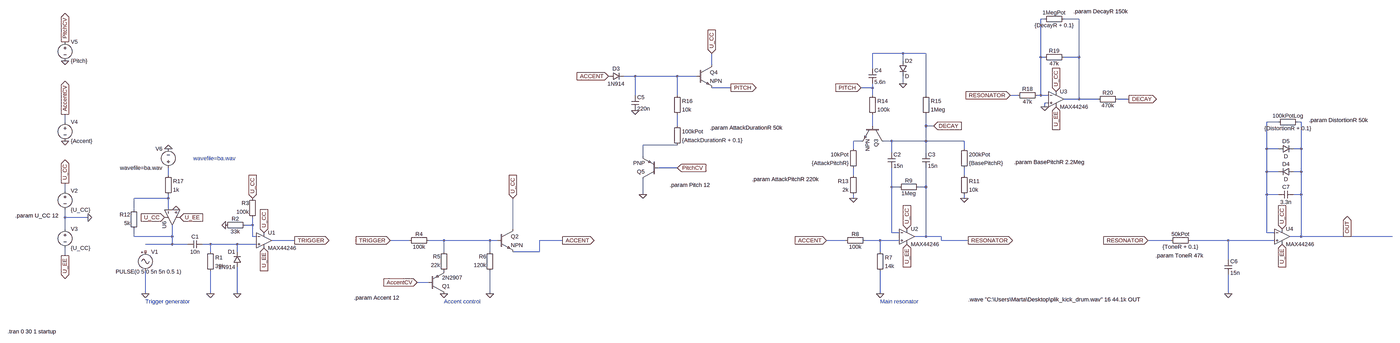
[diagram p0: schematic OPENLAB-KickDrum.asc, whole sheet]
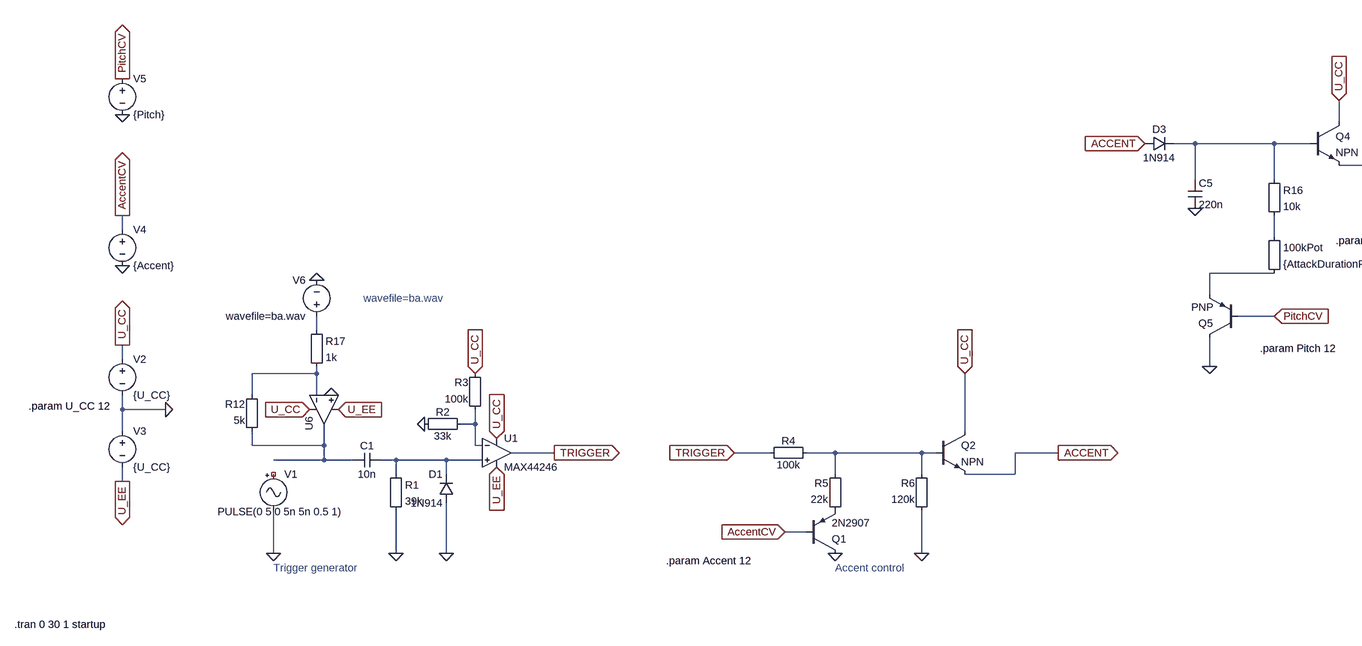
[diagram p1: schematic OPENLAB-KickDrum.asc, part, row 1 of 1, column 1 of 2]
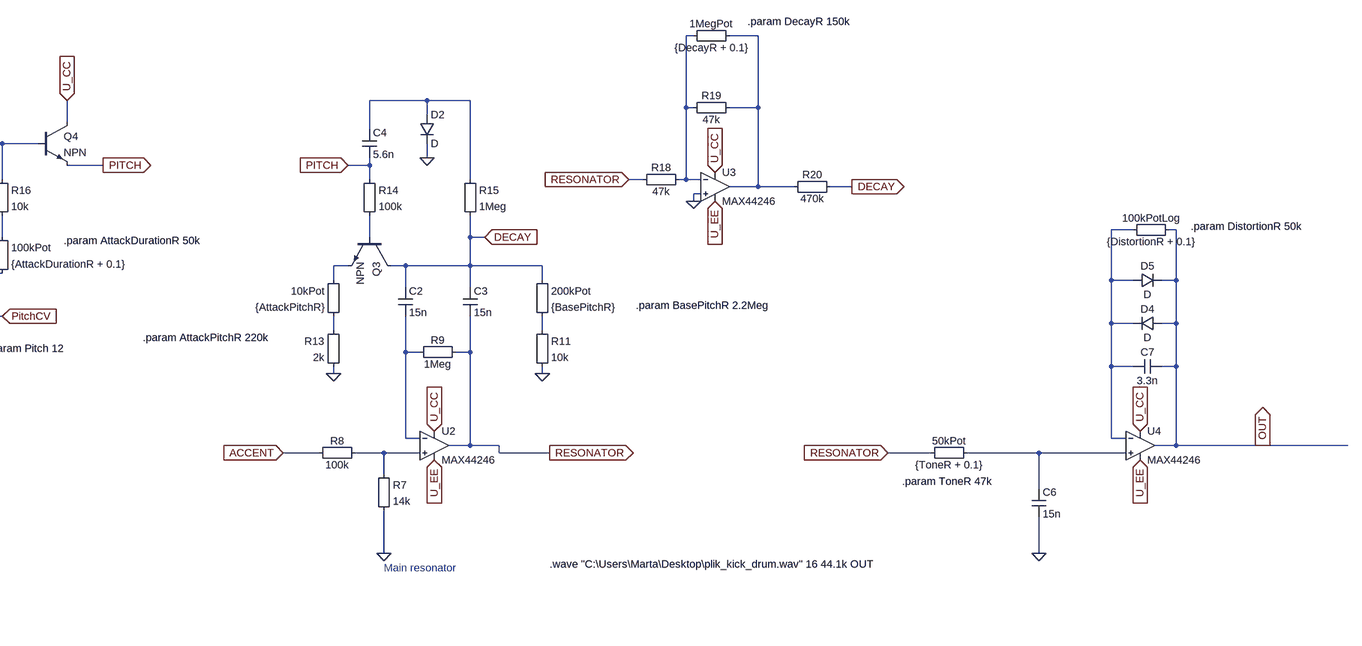
[diagram p2: schematic OPENLAB-KickDrum.asc, part, row 1 of 1, column 2 of 2]
OPENLAB-KickDrum.asc, the LTspice schematic file:
Version 4
SHEET 1 6012 708
WIRE 3888 -848 3872 -848
WIRE 4032 -848 3968 -848
WIRE 3296 -704 3168 -704
WIRE 3392 -704 3296 -704
WIRE 3872 -688 3872 -848
WIRE 3888 -688 3872 -688
WIRE 4032 -688 4032 -848
WIRE 4032 -688 3968 -688
WIRE 3296 -672 3296 -704
WIRE 2496 -656 2496 -704
WIRE 3168 -640 3168 -704
WIRE 2176 -608 2128 -608
WIRE 2352 -608 2176 -608
WIRE 2432 -608 2352 -608
WIRE 3296 -576 3296 -608
WIRE 2576 -560 2496 -560
WIRE 3168 -560 3168 -576
WIRE 3168 -560 3120 -560
WIRE 2176 -528 2176 -608
WIRE 2352 -528 2352 -608
WIRE 3168 -528 3168 -560
WIRE 3392 -528 3392 -704
WIRE 3776 -528 3744 -528
WIRE 3872 -528 3872 -688
WIRE 3872 -528 3856 -528
WIRE 3904 -528 3872 -528
WIRE 4032 -512 4032 -688
WIRE 4032 -512 3968 -512
WIRE 4112 -512 4032 -512
WIRE 4240 -512 4192 -512
WIRE 3904 -496 3888 -496
WIRE 3888 -480 3888 -496
WIRE -320 -416 -320 -448
WIRE 4880 -416 4832 -416
WIRE 4976 -416 4960 -416
WIRE 2352 -400 2352 -448
WIRE 3168 -400 3168 -448
WIRE 3392 -400 3392 -448
WIRE 3424 -400 3392 -400
WIRE 3120 -336 3088 -336
WIRE 3248 -336 3216 -336
WIRE 3392 -336 3392 -400
WIRE 3392 -336 3248 -336
WIRE 3552 -336 3392 -336
WIRE 2352 -320 2208 -320
WIRE 3088 -304 3088 -336
WIRE 3552 -304 3552 -336
WIRE 4832 -304 4832 -416
WIRE 4880 -304 4832 -304
WIRE 4976 -304 4976 -416
WIRE 4976 -304 4944 -304
WIRE 3248 -288 3248 -336
WIRE 3392 -288 3392 -336
WIRE 2208 -272 2208 -320
WIRE 2352 -224 2272 -224
WIRE 4832 -208 4832 -304
WIRE 4880 -208 4832 -208
WIRE 4976 -208 4976 -304
WIRE 4976 -208 4944 -208
WIRE 112 -192 112 -224
WIRE 3088 -192 3088 -224
WIRE 3552 -192 3552 -224
WIRE 3248 -144 3248 -224
WIRE 3280 -144 3248 -144
WIRE 3392 -144 3392 -224
WIRE 3392 -144 3360 -144
WIRE -320 -128 -320 -160
WIRE 2208 -112 2208 -176
WIRE 4832 -112 4832 -208
WIRE 4880 -112 4832 -112
WIRE 4976 -112 4976 -208
WIRE 4976 -112 4944 -112
WIRE 112 -96 112 -112
WIRE 112 -96 -32 -96
WIRE 3088 -96 3088 -112
WIRE 3552 -96 3552 -112
WIRE -32 -48 -32 -96
WIRE 112 -48 112 -96
WIRE -320 -16 -320 -48
WIRE -224 -16 -320 -16
WIRE 464 16 464 -16
WIRE 464 16 432 16
WIRE -320 32 -320 -16
WIRE 1664 32 1664 -96
WIRE 3248 48 3248 -144
WIRE 3280 48 3248 48
WIRE 4832 48 4832 -112
WIRE 4864 48 4832 48
WIRE -32 64 -32 32
WIRE 128 64 128 16
WIRE 128 64 -32 64
WIRE 464 64 464 16
WIRE 480 64 464 64
WIRE 3392 64 3392 -144
WIRE 3392 64 3344 64
WIRE 3456 64 3392 64
WIRE 4976 64 4976 -112
WIRE 4976 64 4928 64
WIRE 5168 64 4976 64
WIRE 5584 64 5168 64
WIRE 640 80 544 80
WIRE 1232 80 1152 80
WIRE 1376 80 1312 80
WIRE 1568 80 1376 80
WIRE 1600 80 1568 80
WIRE 1872 80 1776 80
WIRE 3056 80 2976 80
WIRE 3200 80 3136 80
WIRE 3280 80 3200 80
WIRE 3456 80 3456 64
WIRE 3568 80 3456 80
WIRE 4416 80 4320 80
WIRE 4656 80 4496 80
WIRE 4864 80 4656 80
WIRE 128 96 128 64
WIRE 128 96 16 96
WIRE 192 96 128 96
WIRE 288 96 256 96
WIRE 400 96 288 96
WIRE 480 96 400 96
WIRE 288 128 288 96
WIRE 400 128 400 96
WIRE 1376 128 1376 80
WIRE 1568 128 1568 80
WIRE 1776 128 1776 80
WIRE 1776 128 1664 128
WIRE 3200 128 3200 80
WIRE -320 144 -320 112
WIRE 4656 160 4656 80
WIRE 1312 256 1264 256
WIRE 16 304 16 208
WIRE 288 304 288 208
WIRE 400 304 400 192
WIRE 1568 304 1568 208
WIRE 3200 304 3200 208
WIRE 4656 304 4656 224
FLAG 16 304 0
FLAG 400 304 0
FLAG -224 -16 0
FLAG -320 -160 U_CC
IOPIN -320 -160 Out
FLAG -320 144 U_EE
IOPIN -320 144 Out
FLAG 512 48 U_CC
IOPIN 512 48 In
FLAG 512 112 U_EE
IOPIN 512 112 In
FLAG 464 -96 U_CC
IOPIN 464 -96 In
FLAG 352 16 0
FLAG 288 304 0
FLAG 1568 304 0
FLAG 1376 304 0
FLAG 1664 -96 U_CC
IOPIN 1664 -96 In
FLAG 640 80 TRIGGER
IOPIN 640 80 Out
FLAG 1152 80 TRIGGER
IOPIN 1152 80 In
FLAG 1872 80 ACCENT
IOPIN 1872 80 Out
FLAG 1264 256 AccentCV
IOPIN 1264 256 In
FLAG -320 -336 0
FLAG -320 -448 AccentCV
IOPIN -320 -448 Out
FLAG 3312 96 U_EE
IOPIN 3312 96 In
FLAG 3312 32 U_CC
IOPIN 3312 32 In
FLAG 3200 304 0
FLAG 2976 80 ACCENT
IOPIN 2976 80 In
FLAG 3568 80 RESONATOR
IOPIN 3568 80 Out
FLAG 3552 -96 0
FLAG 3088 -96 0
FLAG 3296 -576 0
FLAG 3120 -560 PITCH
IOPIN 3120 -560 In
FLAG 2576 -560 PITCH
IOPIN 2576 -560 Out
FLAG 2496 -704 U_CC
IOPIN 2496 -704 In
FLAG 2176 -464 0
FLAG 2208 -112 0
FLAG 2064 -608 ACCENT
IOPIN 2064 -608 In
FLAG 2352 -224 PitchCV
IOPIN 2352 -224 In
FLAG 3888 -480 0
FLAG 3936 -544 U_CC
IOPIN 3936 -544 In
FLAG 3936 -480 U_EE
IOPIN 3936 -480 In
FLAG 3744 -528 RESONATOR
IOPIN 3744 -528 In
FLAG 4240 -512 DECAY
IOPIN 4240 -512 Out
FLAG 3424 -400 DECAY
IOPIN 3424 -400 In
FLAG 4320 80 RESONATOR
IOPIN 4320 80 In
FLAG 4656 304 0
FLAG 4896 96 U_EE
IOPIN 4896 96 In
FLAG 4896 32 U_CC
IOPIN 4896 32 In
FLAG 5168 64 OUT
IOPIN 5168 64 Out
FLAG -320 -672 0
FLAG -320 -752 PitchCV
IOPIN -320 -752 Out
FLAG 112 -304 0
FLAG 160 -16 U_EE
IOPIN 160 -16 In
FLAG 96 -16 U_CC
IOPIN 96 -16 In
FLAG 144 -48 0
SYMBOL Misc\\signal 16 112 R0
WINDOW 3 -124 99 Left 2
WINDOW 123 0 0 Left 0
WINDOW 39 0 0 Left 0
SYMATTR Value PULSE(0 5 0 5n 5n 0.5 1)
SYMATTR InstName V1
SYMBOL cap 256 80 R90
WINDOW 0 0 32 VBottom 2
WINDOW 3 32 32 VTop 2
SYMATTR InstName C1
SYMATTR Value 10n
SYMBOL Misc\\EuropeanResistor 272 112 R0
SYMATTR InstName R1
SYMATTR Value 39k
SYMBOL voltage -320 -144 R0
WINDOW 123 0 0 Left 0
WINDOW 39 0 0 Left 0
SYMATTR InstName V2
SYMATTR Value {U_CC}
SYMBOL voltage -320 16 R0
WINDOW 123 0 0 Left 0
WINDOW 39 0 0 Left 0
SYMATTR InstName V3
SYMATTR Value {U_CC}
SYMBOL Misc\\EuropeanResistor 448 0 R90
WINDOW 0 5 56 VBottom 2
WINDOW 3 27 56 VTop 2
SYMATTR InstName R2
SYMATTR Value 33k
SYMBOL Misc\\EuropeanResistor 480 0 R180
WINDOW 0 31 76 Left 2
WINDOW 3 31 40 Left 2
SYMATTR InstName R3
SYMATTR Value 100k
SYMBOL diode 416 192 R180
WINDOW 0 24 64 Left 2
WINDOW 3 24 0 Left 2
SYMATTR InstName D1
SYMATTR Value 1N914
SYMBOL Misc\\EuropeanResistor 1328 64 R90
WINDOW 0 5 56 VBottom 2
WINDOW 3 27 56 VTop 2
SYMATTR InstName R4
SYMATTR Value 100k
SYMBOL Misc\\EuropeanResistor 1392 224 R180
WINDOW 0 31 76 Left 2
WINDOW 3 31 40 Left 2
SYMATTR InstName R5
SYMATTR Value 22k
SYMBOL Misc\\EuropeanResistor 1584 224 R180
WINDOW 0 31 76 Left 2
WINDOW 3 31 40 Left 2
SYMATTR InstName R6
SYMATTR Value 120k
SYMBOL pnp 1312 304 M180
SYMATTR InstName Q1
SYMATTR Value 2N2907
SYMBOL voltage -320 -432 R0
WINDOW 123 0 0 Left 0
WINDOW 39 0 0 Left 0
SYMATTR InstName V4
SYMATTR Value {Accent}
SYMBOL Misc\\EuropeanResistor 3184 112 R0
SYMATTR InstName R7
SYMATTR Value 14k
SYMBOL Misc\\EuropeanResistor 3152 64 R90
WINDOW 0 5 56 VBottom 2
WINDOW 3 27 56 VTop 2
SYMATTR InstName R8
SYMATTR Value 100k
SYMBOL Misc\\EuropeanResistor 3376 -160 R90
WINDOW 0 5 56 VBottom 2
WINDOW 3 27 56 VTop 2
SYMATTR InstName R9
SYMATTR Value 1Meg
SYMBOL cap 3232 -288 R0
SYMATTR InstName C2
SYMATTR Value 15n
SYMBOL cap 3376 -288 R0
SYMATTR InstName C3
SYMATTR Value 15n
SYMBOL Misc\\EuropeanResistor 3536 -320 R0
SYMATTR InstName 200kPot
SYMATTR Value {BasePitchR}
SYMBOL Misc\\EuropeanResistor 3536 -208 R0
SYMATTR InstName R11
SYMATTR Value 10k
SYMBOL Misc\\EuropeanResistor 3104 -320 M0
SYMATTR InstName 10kPot
SYMATTR Value {AttackPitchR}
SYMBOL Misc\\EuropeanResistor 3104 -208 M0
SYMATTR InstName R13
SYMATTR Value 2k
SYMBOL Misc\\EuropeanResistor 3152 -544 R0
SYMATTR InstName R14
SYMATTR Value 100k
SYMBOL Misc\\EuropeanResistor 3376 -544 R0
SYMATTR InstName R15
SYMATTR Value 1Meg
SYMBOL cap 3152 -640 R0
SYMATTR InstName C4
SYMATTR Value 5.6n
SYMBOL diode 2064 -592 R270
WINDOW 0 32 32 VTop 2
WINDOW 3 0 32 VBottom 2
SYMATTR InstName D3
SYMATTR Value 1N914
SYMBOL cap 2160 -528 R0
SYMATTR InstName C5
SYMATTR Value 220n
SYMBOL Misc\\EuropeanResistor 2336 -544 R0
SYMATTR InstName R16
SYMATTR Value 10k
SYMBOL Misc\\EuropeanResistor 2336 -416 R0
SYMATTR InstName 100kPot
SYMATTR Value {AttackDurationR + 0.1}
SYMBOL Misc\\EuropeanResistor 3872 -544 R90
WINDOW 0 5 56 VBottom 2
WINDOW 3 27 56 VTop 2
SYMATTR InstName R18
SYMATTR Value 47k
SYMBOL Misc\\EuropeanResistor 3984 -704 R90
WINDOW 0 5 56 VBottom 2
WINDOW 3 27 56 VTop 2
SYMATTR InstName R19
SYMATTR Value 47k
SYMBOL Misc\\EuropeanResistor 4208 -528 R90
WINDOW 0 5 56 VBottom 2
WINDOW 3 27 56 VTop 2
SYMATTR InstName R20
SYMATTR Value 470k
SYMBOL Misc\\EuropeanResistor 3984 -864 R90
WINDOW 0 5 56 VBottom 2
WINDOW 3 27 56 VTop 2
SYMATTR InstName 1MegPot
SYMATTR Value {DecayR + 0.1}
SYMBOL Misc\\EuropeanResistor 4512 64 R90
WINDOW 0 5 56 VBottom 2
WINDOW 3 27 56 VTop 2
SYMATTR InstName 50kPot
SYMATTR Value {ToneR + 0.1}
SYMBOL cap 4640 160 R0
SYMATTR InstName C6
SYMATTR Value 15n
SYMBOL cap 4944 -128 R90
WINDOW 0 0 32 VBottom 2
WINDOW 3 32 32 VTop 2
SYMATTR InstName C7
SYMATTR Value 3.3n
SYMBOL Misc\\EuropeanResistor 4976 -432 R90
WINDOW 0 5 56 VBottom 2
WINDOW 3 27 56 VTop 2
SYMATTR InstName 100kPotLog
SYMATTR Value {DistortionR + 0.1}
SYMBOL voltage -320 -768 R0
WINDOW 123 0 0 Left 0
WINDOW 39 0 0 Left 0
SYMATTR InstName V5
SYMATTR Value {Pitch}
SYMBOL voltage 112 -208 R180
WINDOW 0 24 96 Left 2
WINDOW 3 24 16 Left 2
SYMATTR InstName V6
SYMATTR Value wavefile=ba.wav
SYMBOL OpAmps\\UniversalOpAmp 128 -16 M90
SYMATTR InstName U6
SYMBOL Misc\\EuropeanResistor -16 48 R180
WINDOW 0 31 76 Left 2
WINDOW 3 31 40 Left 2
SYMATTR InstName R12
SYMATTR Value 5k
SYMBOL Misc\\EuropeanResistor 96 -208 R0
SYMATTR InstName R17
SYMATTR Value 1k
SYMBOL OpAmps\\MAX44246 512 16 R0
SYMATTR InstName U1
SYMBOL OpAmps\\MAX44246 3312 0 R0
SYMATTR InstName U2
SYMBOL OpAmps\\MAX44246 3936 -576 R0
SYMATTR InstName U3
SYMBOL OpAmps\\MAX44246 4896 0 R0
SYMATTR InstName U4
SYMBOL diode 3280 -672 R0
SYMATTR InstName D2
SYMBOL diode 4944 -224 R90
WINDOW 0 0 32 VBottom 2
WINDOW 3 32 32 VTop 2
SYMATTR InstName D4
SYMBOL diode 4880 -288 R270
WINDOW 0 32 32 VTop 2
WINDOW 3 0 32 VBottom 2
SYMATTR InstName D5
SYMBOL pnp 2272 -176 R180
SYMATTR InstName Q5
SYMBOL npn 3216 -400 R90
SYMATTR InstName Q3
SYMBOL npn 2432 -656 R0
SYMATTR InstName Q4
SYMBOL npn 1600 32 R0
SYMATTR InstName Q2
TEXT 16 336 Left 2 ;Trigger generator
TEXT 1376 336 Left 2 ;Accent control
TEXT 3200 336 Left 2 ;Main resonator
TEXT -528 -24 Left 2 !.param U_CC 12
TEXT -560 464 Left 2 !.tran 0 30 1 startup
TEXT 3568 328 Left 2 !.wave "C:\\Users\\Marta\\Desktop\\plik_kick_drum.wav" 16 44.1k OUT
TEXT 4008 -880 Left 2 !.param DecayR 150k
TEXT 3760 -248 Left 2 !.param BasePitchR 2.2Meg
TEXT 2664 -176 Left 2 !.param AttackPitchR 220k
TEXT 2488 -392 Left 2 !.param AttackDurationR 50k
TEXT 4352 144 Left 2 !.param ToneR 47k
TEXT 5008 -424 Left 2 !.param DistortionR 50k
TEXT 2320 -152 Left 2 !.param Pitch 12
TEXT 216 -264 Left 2 ;wavefile=ba.wav
TEXT 1000 320 Left 2 !.param Accent 12

The netlist it stands for:
* OPENLAB-KickDrum.asc
V1 NC_01 0 PULSE(0 5 0 5n 5n 0.5 1)
C1 N020 N016 10n
R1 N020 0 39k
V2 U_CC 0 {U_CC}
V3 0 U_EE {U_CC}
R2 N015 0 33k
R3 N015 U_CC 100k
D1 0 N020 1N914
R4 N017 TRIGGER 100k
R5 P001 N017 22k
R6 0 N017 120k
Q1 0 AccentCV P001 0 2N2907
V4 AccentCV 0 {Accent}
R7 N018 0 14k
R8 N018 ACCENT 100k
R9 RESONATOR N013 1Meg
C2 DECAY N013 15n
C3 DECAY RESONATOR 15n
R§200kPot DECAY N012 {BasePitchR}
R11 N012 0 10k
R§10kPot N008 N011 {AttackPitchR}
R13 N011 0 2k
R14 PITCH N007 100k
R15 N003 DECAY 1Meg
C4 N003 PITCH 5.6n
D3 ACCENT N004 1N914
C5 N004 0 220n
R16 N004 N006 10k
R§100kPot N006 N009 {AttackDurationR + 0.1}
R18 N001 RESONATOR 47k
R19 N002 N001 47k
R20 DECAY N002 470k
R§1MegPot N002 N001 {DecayR + 0.1}
R§50kPot N019 RESONATOR {ToneR + 0.1}
C6 N019 0 15n
C7 OUT N005 3.3n
R§100kPotLog OUT N005 {DistortionR + 0.1}
V5 PitchCV 0 {Pitch}
V6 N010 0 wavefile=ba.wav
XU6 0 N014 U_CC U_EE N016 level1 Avol=1Meg GBW=10Meg Vos=0 En=0 Enk=0 In=0 Ink=0 Rin=500Meg  ; pins In+ In- V+ V- OUT
R12 N016 N014 5k
R17 N010 N014 1k
XU1 N020 N015 U_CC U_EE TRIGGER MAX44246  ; pins In+ In- V+ V- OUT
XU2 N018 N013 U_CC U_EE RESONATOR MAX44246  ; pins In+ In- V+ V- OUT
XU3 0 N001 U_CC U_EE N002 MAX44246  ; pins In+ In- V+ V- OUT
XU4 N019 N005 U_CC U_EE OUT MAX44246  ; pins In+ In- V+ V- OUT
D2 N003 0 D
D4 OUT N005 D
D5 N005 OUT D
Q5 0 PitchCV N009 0 PNP
Q3 DECAY N007 N008 0 NPN
Q4 U_CC N004 PITCH 0 NPN
Q2 U_CC N017 ACCENT 0 NPN
.model D D
.lib standard.dio
.model NPN NPN
.model PNP PNP
.lib standard.bjt
* Trigger generator
* Accent control
* Main resonator
.param U_CC 12
.tran 0 30 1 startup
.wave "C:\Users\Marta\Desktop\plik_kick_drum.wav" 16 44.1k OUT
.param DecayR 150k
.param BasePitchR 2.2Meg
.param AttackPitchR 220k
.param AttackDurationR 50k
.param ToneR 47k
.param DistortionR 50k
.param Pitch 12
* wavefile=ba.wav
.param Accent 12
.lib UniversalOpAmp1.lib
.backanno
.end